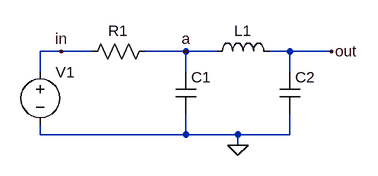
[diagram p0: schematic l_double_c_no_values.asc]
l_double_c_no_values.asc, the LTspice schematic file:
Version 4
SHEET 1 1104 680
WIRE -128 96 -160 96
WIRE -80 96 -128 96
WIRE 64 96 0 96
WIRE 112 96 64 96
WIRE 224 96 192 96
WIRE 288 96 224 96
WIRE -160 128 -160 96
WIRE 64 128 64 96
WIRE 224 128 224 96
WIRE -160 224 -160 208
WIRE 64 224 64 192
WIRE 64 224 -160 224
WIRE 144 224 64 224
WIRE 224 224 224 192
WIRE 224 224 144 224
WIRE 144 240 144 224
FLAG 144 240 0
FLAG -128 96 in
FLAG 288 96 out
FLAG 64 96 a
SYMBOL ind 96 112 R270
WINDOW 0 32 56 VTop 2
WINDOW 3 5 56 VBottom 2
SYMATTR InstName L1
SYMATTR Value ""
SYMATTR SpiceLine Rser=0.00001m
SYMBOL cap 48 128 R0
SYMATTR InstName C1
SYMATTR Value ""
SYMBOL cap 208 128 R0
SYMATTR InstName C2
SYMATTR Value ""
SYMBOL voltage -160 112 R0
WINDOW 3 -31 162 Left 2
WINDOW 123 -31 134 Left 2
WINDOW 39 -31 190 Left 2
SYMATTR InstName V1
SYMATTR Value ""
SYMBOL res 16 80 R90
WINDOW 0 0 56 VBottom 2
WINDOW 3 32 56 VTop 2
SYMATTR InstName R1
SYMATTR Value ""

The netlist it stands for:
* l_double_c_no_values.asc
L1 a out Rser=0.00001m
C1 a 0
C2 out 0
V1 in 0
R1 a in
.backanno
.end